# EAGLE schematic Cruzada_GPS_2015_rev1 (EAGLE 7.4.0)
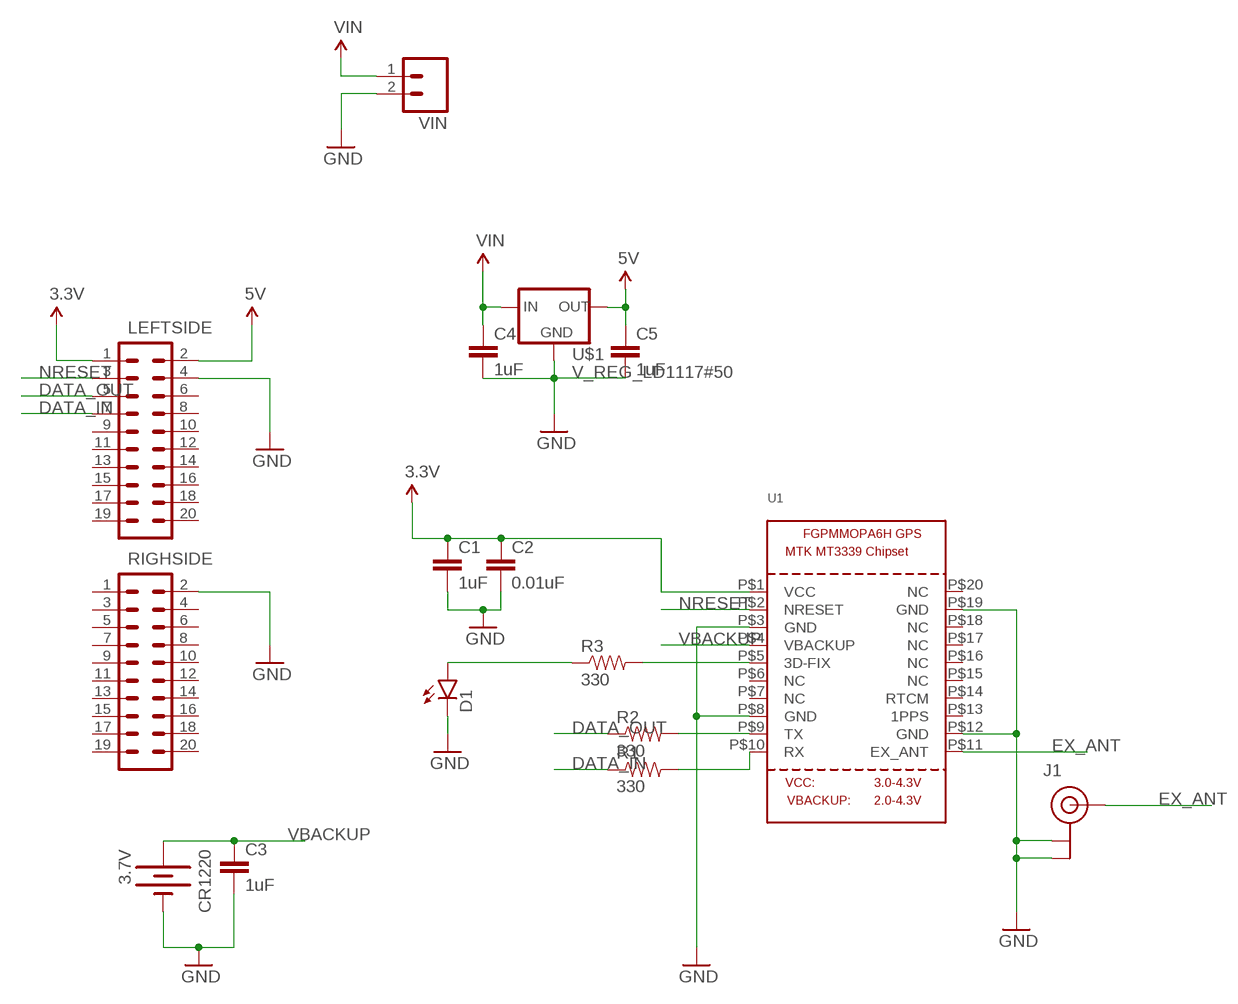
[diagram p0: schematic, sheet 1]

## Parts
C1  1uF  CAP1206  [1206]
C2  0.01uF  CAP1206  [1206]
C3  1uF  CAP1206  [1206]
C4  1uF  CAP1206  [1206]
C5  1uF  CAP1206  [1206]
CR1220  3.7V  BATTERY12MM  [BATTCON_12MM]
D1  LED1206  [LED-1206]
J1  U.FL  [U.FL]
LEFTSIDE  M10X2  [2X10]
R1  330  RESISTOR1206  [1206]
R2  330  RESISTOR1206  [1206]
R3  330  RESISTOR1206  [1206]
RIGHSIDE  M10X2  [2X10]
U1  GPS_FGPMMOPA6H  [FGPMMOPA6H]
U$1  V_REG_LD1117#50  V_REG_MIC2920  [SOT223]
VIN  M02PTH  [1X02]

## Nets
3.3V: C1.1 C2.1 LEFTSIDE.1 U1.P$1(VCC)
5V: C5.1 LEFTSIDE.2 U$1.3(OUT)
DATA_IN: LEFTSIDE.7 R1.1
DATA_OUT: LEFTSIDE.5 R2.1
EX_ANT: J1.P$3(SIGNAL) U1.P$11(EX_ANT)
GND: C1.2 C2.2 C3.2 C4.2 C5.2 CR1220.GND(-) D1.C J1.P$1(GND) J1.P$2(GND) LEFTSIDE.4 RIGHSIDE.2 U1.P$3(GND) U1.P$8(GND) U1.P$12(GND) U1.P$19(GND) U$1.2(GND) VIN.2
N$1: R3.2 U1.P$5(3D-FIX)
N$2: D1.A R3.1
N$3: R2.2 U1.P$9(TX)
N$4: R1.2 U1.P$10(RX)
NRESET: LEFTSIDE.3 U1.P$2(NRESET)
VBACKUP: C3.1 CR1220.PWR@1(+) U1.P$4(VBACKUP)
VIN: C4.1 U$1.1(IN) VIN.1
Unconnected: LEFTSIDE.6 LEFTSIDE.8 LEFTSIDE.9 LEFTSIDE.10 LEFTSIDE.11 LEFTSIDE.12 LEFTSIDE.13 LEFTSIDE.14 LEFTSIDE.15 LEFTSIDE.16 LEFTSIDE.17 LEFTSIDE.18 LEFTSIDE.19 LEFTSIDE.20 RIGHSIDE.1 RIGHSIDE.3 RIGHSIDE.4 RIGHSIDE.5 RIGHSIDE.6 RIGHSIDE.7 RIGHSIDE.8 RIGHSIDE.9 RIGHSIDE.10 RIGHSIDE.11 RIGHSIDE.12 RIGHSIDE.13 RIGHSIDE.14 RIGHSIDE.15 RIGHSIDE.16 RIGHSIDE.17 RIGHSIDE.18 RIGHSIDE.19 RIGHSIDE.20 U1.P$6(NC) U1.P$7(NC) U1.P$13(1PPS) U1.P$14(RTCM) U1.P$15(NC) U1.P$16(NC) U1.P$17(NC) U1.P$18(NC) U1.P$20(NC)

## Library data of the parts
C1-C5 = SparkFun-Capacitors:CAP: Capacitor Standard 0603 ceramic capacitor, and 0.1" leaded capacitor.
CR1220 = SparkFun-Electromechanical:BATTERY: Battery Holders Various common sizes : AA, AAA, 18650 (PRT-12895), 20mm coin cell and 12mm coin cell. 20MM_4LEGS, BATT-10373; PROD_ID: BATT-08044
D1 = SparkFun-LED:LED: LEDs Standard schematic elements and footprints for 5mm, 3mm, 1206, and 0603 sized LEDs. 5mm - Spark Fun Electronics SKU : COM-00529 (and others)
J1 = SparkFun-Connectors:U.FL: SMD antenna connector- WRL-09144; PROD_ID: CONN-09193
LEFTSIDE RIGHSIDE = SparkFun-Connectors:M10X2: This was SPECIALLY designed to be used with our Graphic LCD Backpack. Be sure you want to use this! It is not only staggered on each line of header holes, but IT IS ALSO offset of the center point of the top and bottom lines by 5 mil. This causes the headers to lock into place on the "standard" footprint on the LCD screen. The extra squares on the tdocu layer are there simply to reference other pins (if you were to actually populate a longer header than ten long - this is what we do with the backpacks).
R1-R3 = SparkFun-Resistors:RESISTOR: Resistor Basic schematic elements and footprints for 0603, 1206, and PTH resistors.
U1 = adafruit:GPS_FGPMMOPA6H: GPS Module - MTK MT3339 Chipset, -165dBm sensitivity, 22 channels, 10Hz, auto-select external antenna options
U$1 = SparkFun-PowerIC:V_REG_MIC2920: MIC2920A (http://www.micrel.com/_PDF/mic2920.pdf) - 400mA output LDO Regulator
VIN = SparkFun-Connectors:M02: Standard 2-pin 0.1" header. Use with - straight break away headers ( PRT-00116) - right angle break away headers (PRT-00553) - swiss pins (PRT-00743) - machine pins (PRT-00117) - female headers (PRT-00115) Molex polarized connector foot print use with: PRT-08233 with associated crimp pins and housings. 2.54_SCREWTERM for use with PRT-10571. 3.5mm Screw Terminal footprints for PRT-08084 5mm Screw Terminal footprints for use with PRT-08433